# Altium schematic sheet USB HUB FE1.1.SchDoc
size A4; SheetNumber: 10; SheetTotal: 12
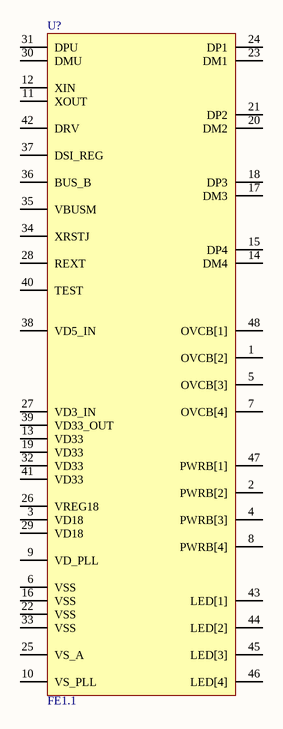
[diagram p0: USB HUB FE1.1.SchDoc]

## Parts
U?  FE1.1  [TSQFP50P900X900X160-48N]

## Nets

Not connected (* = marked no-connect by the designer): U? 1(OVCB[2]) 2(PWRB[2]) 3(VD18) 4(PWRB[3]) 5(OVCB[3]) 6(VSS) 7(OVCB[4]) 8(PWRB[4]) 9(VD_PLL) 10(VS_PLL) 11(XOUT) 12(XIN) 13(VD33) 14(DM4) 15(DP4) 16(VSS) 17(DM3) 18(DP3) 19(VD33) 20(DM2) 21(DP2) 22(VSS) 23(DM1) 24(DP1) 25(VS_A) 26(VREG18) 27(VD3_IN) 28(REXT) 29(VD18) 30(DMU) 31(DPU) 32(VD33) 33(VSS) 34(XRSTJ) 35(VBUSM) 36(BUS_B) 37(DSI_REG) 38(VD5_IN) 39(VD33_OUT) 40(TEST) 41(VD33) 42(DRV) 43(LED[1]) 44(LED[2]) 45(LED[3]) 46(LED[4]) 47(PWRB[1]) 48(OVCB[1])

## Library data of the parts
U? = FE1.1: MANUFACTURER: Terminus Tech; Part Number: FE1.1; COMPONENTLINK1URL: https://datasheet.lcsc.com/lcsc/2303171730_Terminus-Tech-FE1-1S-BSOP28BCN_C9359.pdf; COMPONENTLINK1DESCRIPTION: Datasheet; PACKAGE: LQFP-48(7x7); Part Status: Active